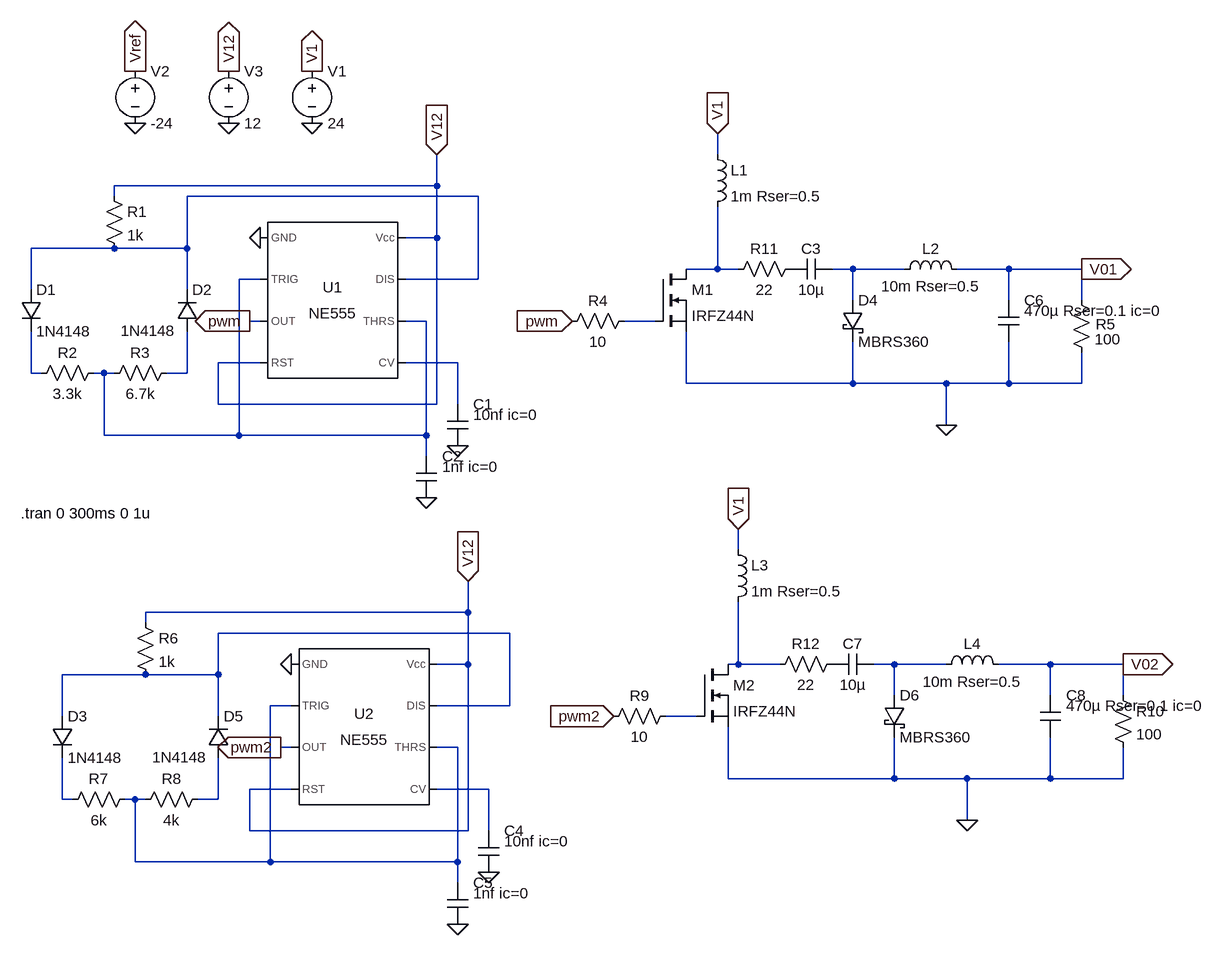
[diagram p0: schematic buckboostv3.asc]
buckboostv3.asc, the LTspice schematic file:
Version 4.1
SHEET 1 1624 1336
WIRE 816 -32 816 -64
WIRE 384 16 384 -32
WIRE 384 16 -112 16
WIRE -112 32 -112 16
WIRE 448 32 0 32
WIRE 384 96 384 16
WIRE 384 96 336 96
WIRE -112 112 -240 112
WIRE 0 112 0 32
WIRE 0 112 -112 112
WIRE 816 144 816 48
WIRE 816 144 768 144
WIRE 848 144 816 144
WIRE 1024 144 992 144
WIRE 1104 144 1024 144
WIRE 1264 144 1184 144
WIRE 1376 144 1264 144
WIRE 112 160 80 160
WIRE 448 160 448 32
WIRE 448 160 336 160
WIRE -240 176 -240 112
WIRE 0 176 0 112
WIRE 1024 192 1024 144
WIRE 1264 192 1264 144
WIRE 1376 192 1376 144
WIRE 112 224 96 224
WIRE 368 224 336 224
WIRE 720 224 672 224
WIRE 112 288 48 288
WIRE 416 288 336 288
WIRE -240 304 -240 240
WIRE -224 304 -240 304
WIRE -128 304 -144 304
WIRE -112 304 -128 304
WIRE 0 304 0 240
WIRE 0 304 -32 304
WIRE 768 320 768 240
WIRE 1024 320 1024 256
WIRE 1024 320 768 320
WIRE 1168 320 1024 320
WIRE 1264 320 1264 256
WIRE 1264 320 1168 320
WIRE 1376 320 1376 272
WIRE 1376 320 1264 320
WIRE 48 352 48 288
WIRE 384 352 384 96
WIRE 384 352 48 352
WIRE 416 352 416 288
WIRE 1168 384 1168 320
WIRE -128 400 -128 304
WIRE 80 400 80 160
WIRE 80 400 -128 400
WIRE 368 400 368 224
WIRE 368 400 80 400
WIRE 368 432 368 400
WIRE 848 576 848 544
WIRE 432 672 432 624
WIRE 432 672 -64 672
WIRE -64 688 -64 672
WIRE 496 704 48 704
WIRE 432 752 432 672
WIRE 432 752 384 752
WIRE 848 752 848 656
WIRE 848 752 832 752
WIRE 912 752 848 752
WIRE 1088 752 1056 752
WIRE 1168 752 1088 752
WIRE 1328 752 1248 752
WIRE 1440 752 1328 752
WIRE -64 768 -192 768
WIRE 48 768 48 704
WIRE 48 768 -64 768
WIRE 1088 800 1088 752
WIRE 1328 800 1328 752
WIRE 1440 800 1440 752
WIRE 160 816 128 816
WIRE 496 816 496 704
WIRE 496 816 384 816
WIRE -192 832 -192 768
WIRE 48 832 48 768
WIRE 784 832 736 832
WIRE 160 880 144 880
WIRE 416 880 384 880
WIRE 832 928 832 848
WIRE 1088 928 1088 864
WIRE 1088 928 832 928
WIRE 1200 928 1088 928
WIRE 1328 928 1328 864
WIRE 1328 928 1200 928
WIRE 1440 928 1440 880
WIRE 1440 928 1328 928
WIRE 160 944 96 944
WIRE 464 944 384 944
WIRE -192 960 -192 896
WIRE -176 960 -192 960
WIRE -80 960 -96 960
WIRE -64 960 -80 960
WIRE 48 960 48 896
WIRE 48 960 16 960
WIRE 1200 992 1200 928
WIRE 96 1008 96 944
WIRE 432 1008 432 752
WIRE 432 1008 96 1008
WIRE 464 1008 464 944
WIRE -80 1056 -80 960
WIRE 128 1056 128 816
WIRE 128 1056 -80 1056
WIRE 416 1056 416 880
WIRE 416 1056 128 1056
WIRE 416 1088 416 1056
FLAG 416 416 0
FLAG 368 496 0
FLAG 384 -32 V12
IOPIN 384 -32 In
FLAG 96 224 pwm
IOPIN 96 224 Out
FLAG 592 224 pwm
IOPIN 592 224 In
FLAG 192 -80 0
FLAG 192 -160 V1
IOPIN 192 -160 Out
FLAG 160 752 0
FLAG 464 1072 0
FLAG 416 1152 0
FLAG 432 624 V12
IOPIN 432 624 In
FLAG 144 880 pwm2
IOPIN 144 880 Out
FLAG 656 832 pwm2
IOPIN 656 832 In
FLAG 64 -80 0
FLAG 64 -160 V12
IOPIN 64 -160 Out
FLAG 816 -64 V1
IOPIN 816 -64 In
FLAG 1376 144 V01
IOPIN 1376 144 Out
FLAG 848 544 V1
IOPIN 848 544 In
FLAG 1440 752 V02
IOPIN 1440 752 Out
FLAG 1168 384 0
FLAG 1200 992 0
FLAG 112 96 0
FLAG -80 -80 0
FLAG -80 -160 Vref
IOPIN -80 -160 Out
SYMBOL Misc\\NE555 224 192 R0
SYMATTR InstName U1
SYMBOL cap 400 352 R0
WINDOW 0 40 0 Left 2
WINDOW 3 40 16 Left 2
SYMATTR InstName C1
SYMATTR Value 10nf ic=0
SYMBOL res -128 16 R0
SYMATTR InstName R1
SYMATTR Value 1k
SYMBOL diode -256 176 R0
SYMATTR InstName D1
SYMATTR Value 1N4148
SYMBOL diode -16 240 M180
WINDOW 0 24 64 Left 2
WINDOW 3 -86 1 Left 2
SYMATTR InstName D2
SYMATTR Value 1N4148
SYMBOL res -128 288 R90
WINDOW 0 0 56 VBottom 2
WINDOW 3 32 56 VTop 2
SYMATTR InstName R2
SYMATTR Value 3.3k
SYMBOL res -16 288 R90
WINDOW 0 0 56 VBottom 2
WINDOW 3 32 56 VTop 2
SYMATTR InstName R3
SYMATTR Value 6.7k
SYMBOL cap 352 432 R0
WINDOW 0 40 0 Left 2
WINDOW 3 40 16 Left 2
SYMATTR InstName C2
SYMATTR Value 1nf ic=0
SYMBOL res 688 208 R90
WINDOW 0 0 56 VBottom 2
WINDOW 3 32 56 VTop 2
SYMATTR InstName R4
SYMATTR Value 10
SYMBOL voltage 192 -176 R0
WINDOW 123 0 0 Left 0
WINDOW 39 0 0 Left 0
SYMATTR InstName V1
SYMATTR Value 24
SYMBOL nmos 720 144 R0
SYMATTR InstName M1
SYMATTR Value IRFZ44N
SYMBOL Misc\\NE555 272 848 R0
SYMATTR InstName U2
SYMBOL cap 448 1008 R0
WINDOW 0 40 0 Left 2
WINDOW 3 40 16 Left 2
SYMATTR InstName C4
SYMATTR Value 10nf ic=0
SYMBOL res -80 672 R0
SYMATTR InstName R6
SYMATTR Value 1k
SYMBOL diode -208 832 R0
SYMATTR InstName D3
SYMATTR Value 1N4148
SYMBOL diode 32 896 M180
WINDOW 0 24 64 Left 2
WINDOW 3 -86 1 Left 2
SYMATTR InstName D5
SYMATTR Value 1N4148
SYMBOL res -80 944 R90
WINDOW 0 0 56 VBottom 2
WINDOW 3 32 56 VTop 2
SYMATTR InstName R7
SYMATTR Value 6k
SYMBOL res 32 944 R90
WINDOW 0 0 56 VBottom 2
WINDOW 3 32 56 VTop 2
SYMATTR InstName R8
SYMATTR Value 4k
SYMBOL cap 400 1088 R0
WINDOW 0 40 0 Left 2
WINDOW 3 40 16 Left 2
SYMATTR InstName C5
SYMATTR Value 1nf ic=0
SYMBOL res 752 816 R90
WINDOW 0 0 56 VBottom 2
WINDOW 3 32 56 VTop 2
SYMATTR InstName R9
SYMATTR Value 10
SYMBOL voltage 64 -176 R0
WINDOW 123 0 0 Left 0
WINDOW 39 0 0 Left 0
SYMATTR InstName V3
SYMATTR Value 12
SYMBOL ind 800 -48 R0
SYMATTR InstName L1
SYMATTR Value 1m Rser=0.5
SYMBOL cap 992 128 R90
WINDOW 0 0 32 VBottom 2
WINDOW 3 32 32 VTop 2
SYMATTR InstName C3
SYMATTR Value 10µ
SYMBOL schottky 1008 192 R0
SYMATTR InstName D4
SYMATTR Value MBRS360
SYMATTR Description Diode
SYMATTR Type diode
SYMBOL ind 1088 160 R270
WINDOW 0 32 56 VTop 2
WINDOW 3 5 56 VBottom 2
SYMATTR InstName L2
SYMATTR Value 10m Rser=0.5
SYMBOL cap 1248 192 R0
WINDOW 0 40 0 Left 2
WINDOW 3 40 16 Left 2
SYMATTR InstName C6
SYMATTR Value 470µ Rser=0.1 ic=0
SYMBOL res 1360 176 R0
WINDOW 0 38 53 Left 2
SYMATTR InstName R5
SYMATTR Value 100
SYMBOL nmos 784 752 R0
SYMATTR InstName M2
SYMATTR Value IRFZ44N
SYMBOL ind 832 560 R0
SYMATTR InstName L3
SYMATTR Value 1m Rser=0.5
SYMBOL cap 1056 736 R90
WINDOW 0 0 32 VBottom 2
WINDOW 3 32 32 VTop 2
SYMATTR InstName C7
SYMATTR Value 10µ
SYMBOL schottky 1072 800 R0
SYMATTR InstName D6
SYMATTR Value MBRS360
SYMATTR Description Diode
SYMATTR Type diode
SYMBOL ind 1152 768 R270
WINDOW 0 32 56 VTop 2
WINDOW 3 5 56 VBottom 2
SYMATTR InstName L4
SYMATTR Value 10m Rser=0.5
SYMBOL cap 1312 800 R0
WINDOW 0 40 0 Left 2
WINDOW 3 40 16 Left 2
SYMATTR InstName C8
SYMATTR Value 470µ Rser=0.1 ic=0
SYMBOL res 1424 784 R0
SYMATTR InstName R10
SYMATTR Value 100
SYMBOL res 944 128 R90
WINDOW 0 0 56 VBottom 2
WINDOW 3 32 56 VTop 2
SYMATTR InstName R11
SYMATTR Value 22
SYMBOL res 1008 736 R90
WINDOW 0 0 56 VBottom 2
WINDOW 3 32 56 VTop 2
SYMATTR InstName R12
SYMATTR Value 22
SYMBOL voltage -80 -176 R0
WINDOW 123 0 0 Left 0
WINDOW 39 0 0 Left 0
SYMATTR InstName V2
SYMATTR Value -24
TEXT -256 520 Left 2 !.tran 0 300ms 0 1u

The netlist it stands for:
* buckboostv3.asc
X§U1 0 N004 pwm V12 N006 N004 N001 V12 NE555  ; pins GND TRIG OUT RST CV THRS DIS Vcc
C1 N006 0 10nf ic=0
R1 V12 N001 1k
D1 N001 N007 1N4148
D2 N008 N001 1N4148
R2 N004 N007 3.3k
R3 N008 N004 6.7k
C2 N004 0 1nf ic=0
R4 N005 pwm 10
V1 V1 0 24
M1 N002 N005 0 0 IRFZ44N
X§U2 0 N012 pwm2 V12 N014 N012 N009 V12 NE555  ; pins GND TRIG OUT RST CV THRS DIS Vcc
C4 N014 0 10nf ic=0
R6 V12 N009 1k
D3 N009 N015 1N4148
D5 N016 N009 1N4148
R7 N012 N015 6k
R8 N016 N012 4k
C5 N012 0 1nf ic=0
R9 N013 pwm2 10
V3 V12 0 12
L1 V1 N002 1m Rser=0.5
C3 N003 P001 10µ
D4 N003 0 MBRS360
L2 N003 V01 10m Rser=0.5
C6 V01 0 470µ Rser=0.1 ic=0
R5 V01 0 100
M2 N010 N013 0 0 IRFZ44N
L3 V1 N010 1m Rser=0.5
C7 N011 P002 10µ
D6 N011 0 MBRS360
L4 N011 V02 10m Rser=0.5
C8 V02 0 470µ Rser=0.1 ic=0
R10 V02 0 100
R11 P001 N002 22
R12 P002 N010 22
V2 Vref 0 -24
.model D D
.lib standard.dio
.model NMOS NMOS
.model PMOS PMOS
.lib standard.mos
.tran 0 300ms 0 1u
.lib NE555.sub
.backanno
.end